# EAGLE design DigitalIO_3_3V_LevelShift (EAGLE 7.7.0)
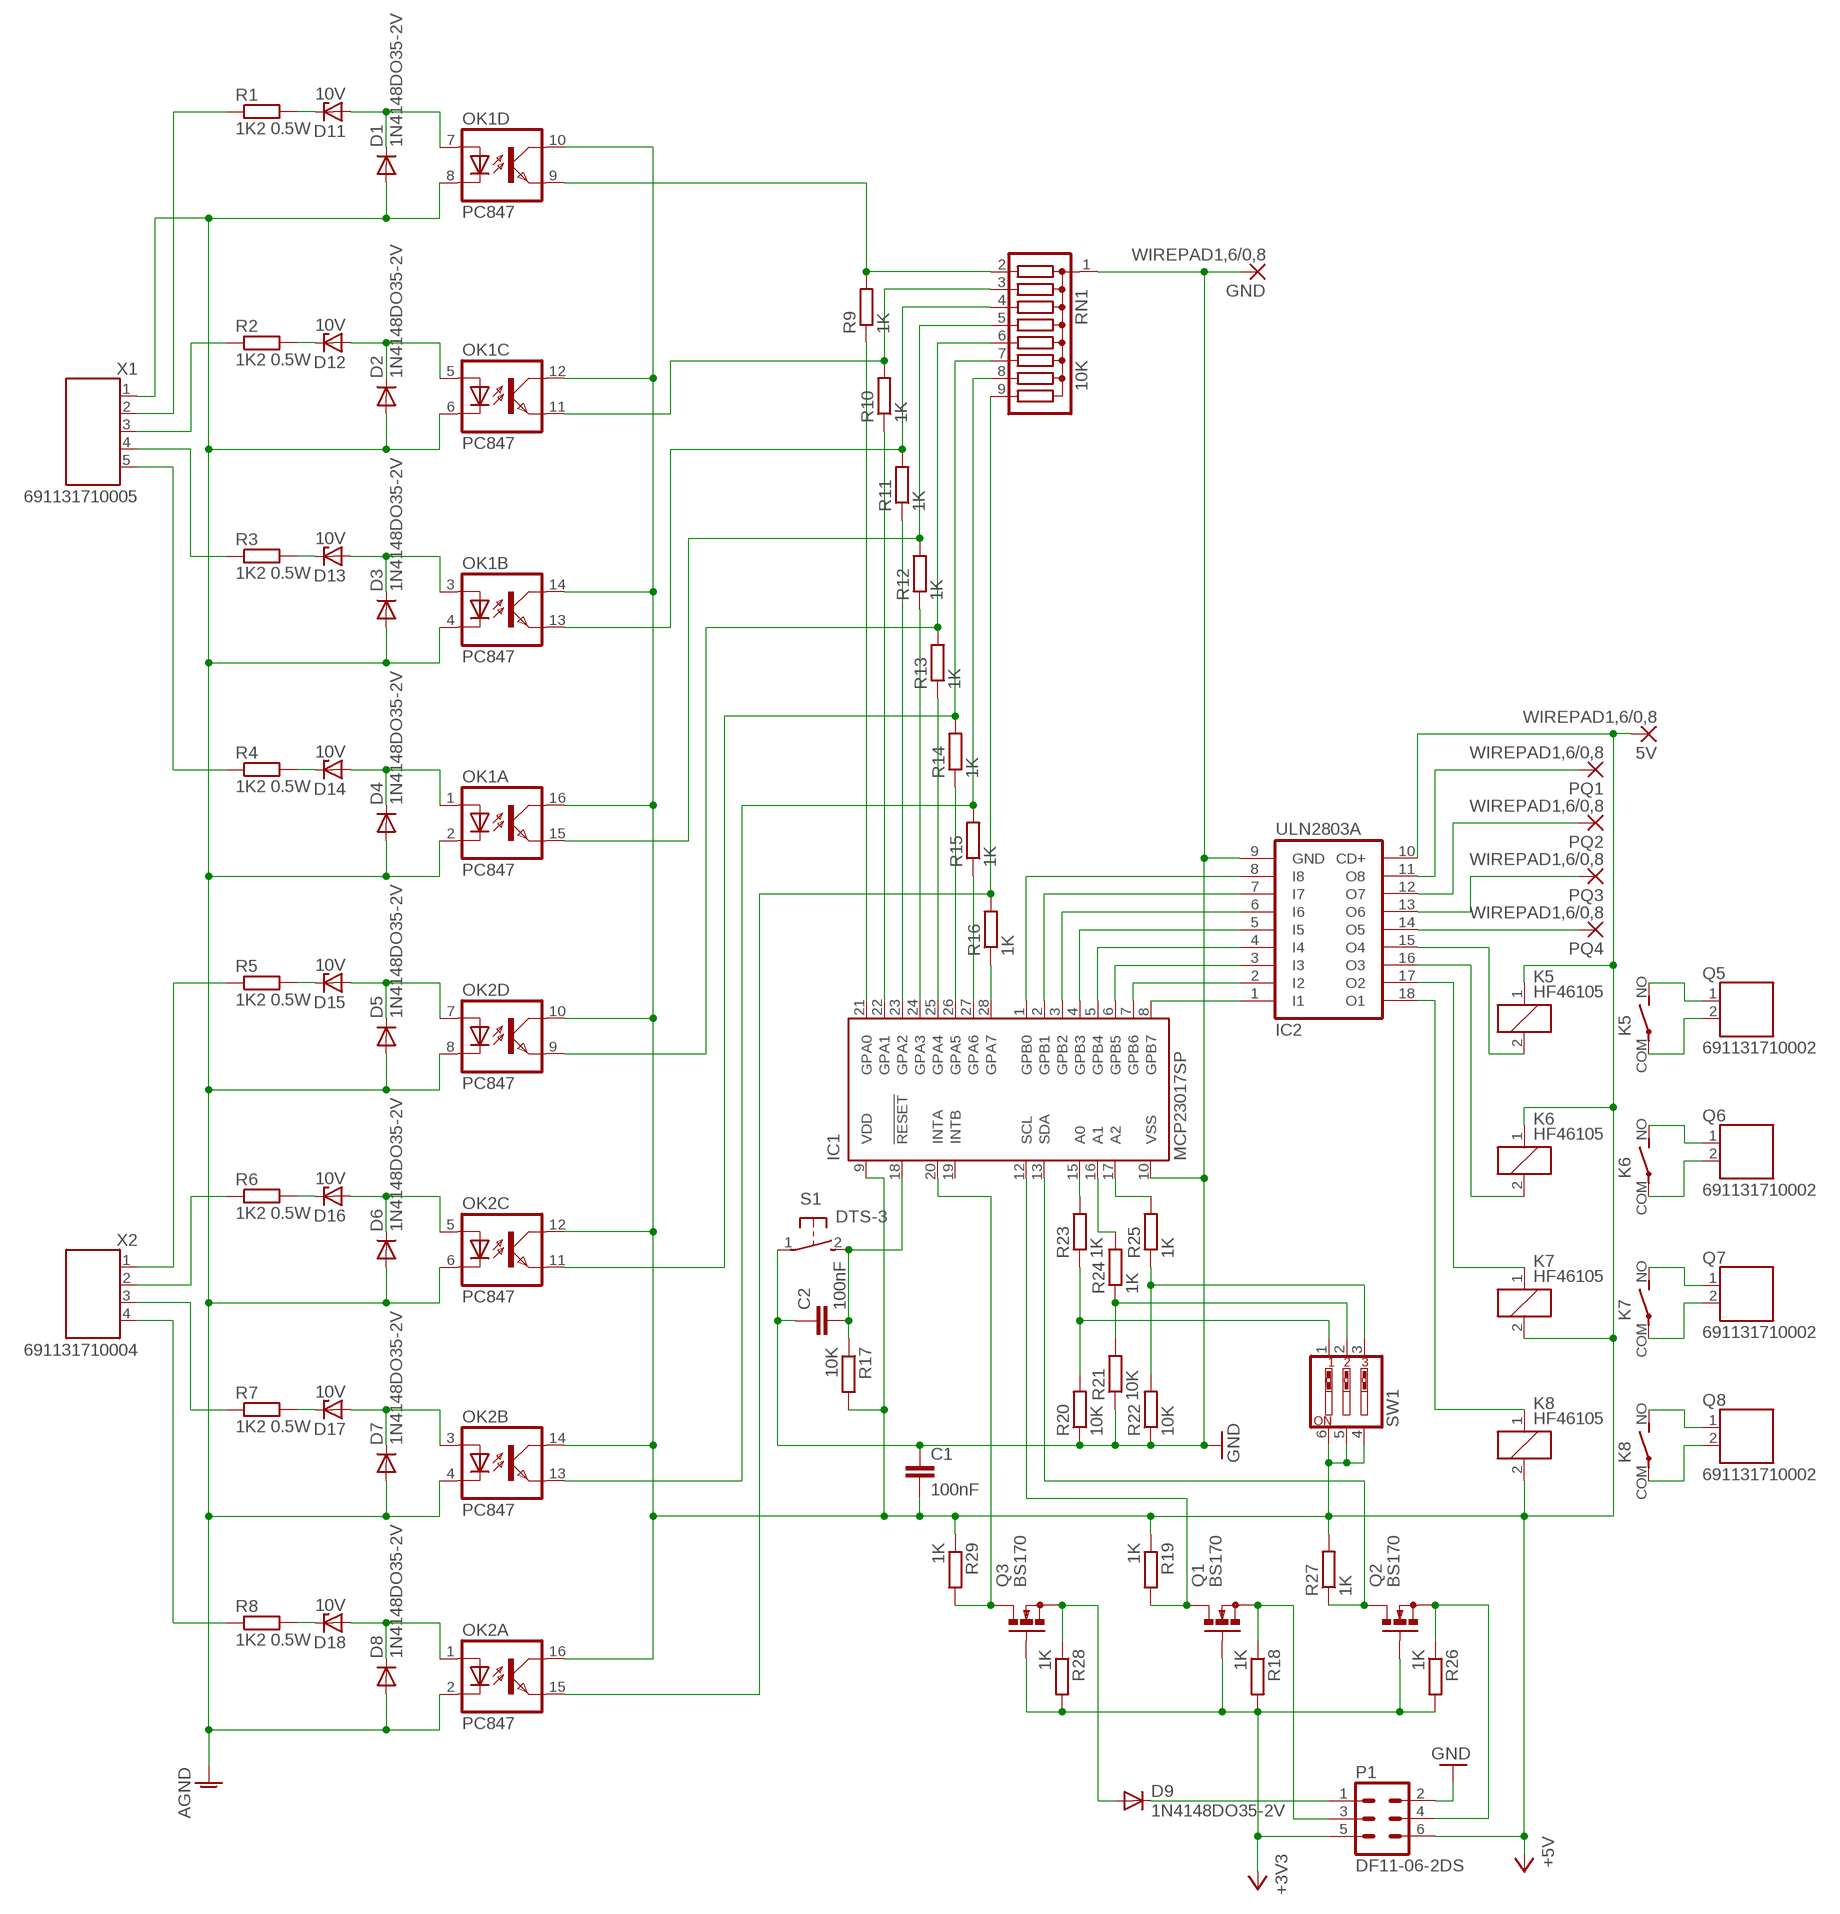
[diagram p0: schematic, sheet 1]

## Parts
5V  WIREPAD1,6/0,8  [1,6/0,8]
C1  100nF  C-EUC0805  [C0805]
C2  100nF  C-EUC0805  [C0805]
D1  1N4148DO35-2V  [DO35-2V]
D2  1N4148DO35-2V  [DO35-2V]
D3  1N4148DO35-2V  [DO35-2V]
D4  1N4148DO35-2V  [DO35-2V]
D5  1N4148DO35-2V  [DO35-2V]
D6  1N4148DO35-2V  [DO35-2V]
D7  1N4148DO35-2V  [DO35-2V]
D8  1N4148DO35-2V  [DO35-2V]
D9  1N4148DO35-2V  [DO35-2V]
D11  10V  ZENER-DIODEZD-2.5  [ZDIO-2.5]
D12  10V  ZENER-DIODEZD-2.5  [ZDIO-2.5]
D13  10V  ZENER-DIODEZD-2.5  [ZDIO-2.5]
D14  10V  ZENER-DIODEZD-2.5  [ZDIO-2.5]
D15  10V  ZENER-DIODEZD-2.5  [ZDIO-2.5]
D16  10V  ZENER-DIODEZD-2.5  [ZDIO-2.5]
D17  10V  ZENER-DIODEZD-2.5  [ZDIO-2.5]
D18  10V  ZENER-DIODEZD-2.5  [ZDIO-2.5]
GND  WIREPAD1,6/0,8  [1,6/0,8]
IC1  MCP23017SP  [DIL28-3]
IC2  ULN2803A  [DIL18]
K5  HF46105  [HF46]
K6  HF46105  [HF46]
K7  HF46105  [HF46]
K8  HF46105  [HF46]
OK1  PC847  [DIL16]
OK2  PC847  [DIL16]
P1  DF11-06-2DS  [DF11-06DP-2DS]
PQ1  WIREPAD1,6/0,8  [1,6/0,8]
PQ2  WIREPAD1,6/0,8  [1,6/0,8]
PQ3  WIREPAD1,6/0,8  [1,6/0,8]
PQ4  WIREPAD1,6/0,8  [1,6/0,8]
Q1  BS170  [SOT54E]
Q2  BS170  [SOT54E]
Q3  BS170  [SOT54E]
Q5  691131710002  [691131710002]
Q6  691131710002  [691131710002]
Q7  691131710002  [691131710002]
Q8  691131710002  [691131710002]
R1  1K2 0.5W  R-EU_0207/2V  [0207/2V]
R2  1K2 0.5W  R-EU_0207/2V  [0207/2V]
R3  1K2 0.5W  R-EU_0207/2V  [0207/2V]
R4  1K2 0.5W  R-EU_0207/2V  [0207/2V]
R5  1K2 0.5W  R-EU_0207/2V  [0207/2V]
R6  1K2 0.5W  R-EU_0207/2V  [0207/2V]
R7  1K2 0.5W  R-EU_0207/2V  [0207/2V]
R8  1K2 0.5W  R-EU_0207/2V  [0207/2V]
R9  1K  R-EU_0204/2V  [0204V]
R10  1K  R-EU_0204/2V  [0204V]
R11  1K  R-EU_0204/2V  [0204V]
R12  1K  R-EU_0204/2V  [0204V]
R13  1K  R-EU_0204/2V  [0204V]
R14  1K  R-EU_0204/2V  [0204V]
R15  1K  R-EU_0204/2V  [0204V]
R16  1K  R-EU_0204/2V  [0204V]
R17  10K  R-EU_0204/2V  [0204V]
R18  1K  R-EU_0204/2V  [0204V]
R19  1K  R-EU_0204/2V  [0204V]
R20  10K  R-EU_0204/2V  [0204V]
R21  10K  R-EU_0204/2V  [0204V]
R22  10K  R-EU_0204/2V  [0204V]
R23  1K  R-EU_0204/2V  [0204V]
R24  1K  R-EU_0204/2V  [0204V]
R25  1K  R-EU_0204/2V  [0204V]
R26  1K  R-EU_0204/2V  [0204V]
R27  1K  R-EU_0204/2V  [0204V]
R28  1K  R-EU_0204/2V  [0204V]
R29  1K  R-EU_0204/2V  [0204V]
RN1  10K  G08R  [SIL9]
S1  DTS-3  [DTS-3]
SW1  SW_DIP-3  [EDG-03]
X1  691131710005  [691131710005]
X2  691131710004  [691131710004]

## Nets
+3V3: P1.5 Q1.G Q2.G Q3.G R18.2 R26.2 R28.2
+5V: 5V.1(P) C1.2 IC1.9(VDD) IC2.10(CD+) K5.1 K6.1 K7.2 K8.2 OK1.10(D:COL) OK1.12(C:COL) OK1.14(B:COL) OK1.16(A:COL) OK2.10(D:COL) OK2.12(C:COL) OK2.14(B:COL) OK2.16(A:COL) P1.6 R17.2 R19.1 R27.2 R29.1 SW1.4 SW1.5 SW1.6
AGND: D1.A D2.A D3.A D4.A D5.A D6.A D7.A D8.A OK1.2(A:C) OK1.4(B:C) OK1.6(C:C) OK1.8(D:C) OK2.2(A:C) OK2.4(B:C) OK2.6(C:C) OK2.8(D:C) X1.1
GND: C1.1 C2.1 GND.1(P) IC1.10(VSS) IC2.9(GND) P1.2 R20.1 R21.1 R22.1 RN1.1 S1.1
N$1: IC1.8(GPB7) IC2.1(I1)
N$2: IC1.7(GPB6) IC2.2(I2)
N$3: IC1.6(GPB5) IC2.3(I3)
N$4: IC1.5(GPB4) IC2.4(I4)
N$5: IC1.4(GPB3) IC2.5(I5)
N$6: IC1.3(GPB2) IC2.6(I6)
N$7: IC1.2(GPB1) IC2.7(I7)
N$8: IC1.1(GPB0) IC2.8(I8)
N$9: D12.C R2.2
N$10: D11.C R1.2
N$11: R22.2 R25.1 SW1.3
N$12: D1.C D11.A OK1.7(D:A)
N$13: R6.1 X2.2
N$14: R2.1 X1.3
N$15: OK1.9(D:EMIT) R9.2 RN1.2
N$16: R3.1 X1.4
N$17: R7.1 X2.3
N$18: R1.1 X1.2
N$19: D2.C D12.A OK1.5(C:A)
N$20: OK1.11(C:EMIT) R10.2 RN1.3
N$21: D13.C R3.2
N$22: R4.1 X1.5
N$23: D3.C D13.A OK1.3(B:A)
N$24: R5.1 X2.1
N$25: OK1.13(B:EMIT) R11.2 RN1.4
N$26: R8.1 X2.4
N$27: D14.C R4.2
N$28: IC2.14(O5) PQ4.1(P)
N$29: D4.C D14.A OK1.1(A:A)
N$30: IC2.13(O6) PQ3.1(P)
N$31: OK1.15(A:EMIT) R12.2 RN1.5
N$32: IC2.12(O7) PQ2.1(P)
N$33: D15.C R5.2
N$34: IC2.11(O8) PQ1.1(P)
N$35: D5.C D15.A OK2.7(D:A)
N$36: D9.A Q3.S R28.1
N$37: OK2.9(D:EMIT) R13.2 RN1.6
N$38: K8.NO(2:S) Q8.1
N$39: D16.C R6.2
N$40: K8.COM(2:P) Q8.2
N$41: D6.C D16.A OK2.5(C:A)
N$42: IC2.15(O4) K5.2
N$43: OK2.11(C:EMIT) R14.2 RN1.7
N$44: K7.NO(2:S) Q7.1
N$45: D17.C R7.2
N$46: K7.COM(2:P) Q7.2
N$47: D7.C D17.A OK2.3(B:A)
N$48: IC2.16(O3) K6.2
N$49: OK2.13(B:EMIT) R15.2 RN1.8
N$50: IC1.15(A0) R23.2
N$51: D18.C R8.2
N$52: IC1.16(A1) R24.2
N$53: D8.C D18.A OK2.1(A:A)
N$54: IC2.17(O2) K7.1
N$55: OK2.15(A:EMIT) R16.2 RN1.9
N$56: IC2.18(O1) K8.1
N$57: C2.2 IC1.18(!RESET) R17.1 S1.2
N$58: IC1.12(SCL) Q1.D R19.2
N$59: IC1.21(GPA0) R9.1
N$60: IC1.22(GPA1) R10.1
N$61: IC1.13(SDA) Q2.D R27.1
N$62: IC1.23(GPA2) R11.1
N$63: IC1.28(GPA7) R16.1
N$64: IC1.27(GPA6) R15.1
N$65: IC1.26(GPA5) R14.1
N$66: K5.NO(2:S) Q5.1
N$67: IC1.25(GPA4) R13.1
N$68: IC1.24(GPA3) R12.1
N$69: P1.4 Q2.S R26.1
N$71: P1.3 Q1.S R18.1
N$75: K5.COM(2:P) Q5.2
N$77: R20.2 R23.1 SW1.1
N$78: R21.2 R24.1 SW1.2
N$79: IC1.17(A2) R25.2
N$80: D9.C P1.1
N$81: IC1.20(INTA) Q3.D R29.2
N$88: K6.NO(2:S) Q6.1
N$89: K6.COM(2:P) Q6.2
Unconnected: IC1.19(INTB)

## Library data of the parts
5V GND PQ1-PQ4 = wirepad:WIREPAD: Wire PAD connect wire on PCB
C1 C2 = rcl:C-EU: CAPACITOR, European symbol; MF: MULTICOMP; MPN: MCRR50104X7RK0050; OC_FARNELL: 1216440
D1-D9 = diode:1N4148: DIODE high speed (Philips); OC_FARNELL: unknown
D11-D18 = diode:ZENER-DIODE: Z-Diode; OC_FARNELL: unknown
IC1 = mcp:MCP23017: Input/Output Expander Source: https://www.microchip.com/en-us/product/MCP23017
IC2 = uln-udn:ULN2803A: DRIVER ARRAY; MF: STMICROELECTRONICS; MPN: ULN2803A; OC_FARNELL: 1094428
K5-K8 = hongfa:HF46?*: Slim Power Relay NAiS Source: http://www.hongfa.com/pro/pdf/HF46F_en.pdf; OC_FARNELL: unknown; OC_NEWARK: unknown
OK1 OK2 = optocoupler:PC847: SHARP OPTO COUPLER; OC_FARNELL: 9707735; OC_NEWARK: unknown
P1 = con-hirose-df11:DF11-06-2: HEADER; OC_FARNELL: unknown
Q1-Q3 = transistor-small-signal:BS170: N-CHANNEL MOS FET; MF: ON SEMICONDUCTOR; MPN: BS170G; OC_FARNELL: 9556192
Q5-Q8 = con-wuerth:691131710002: WR-TBL Terminal block - CUU5/2 CUU5/2GR - 2 Pins;=>Code : Con_TBL_Screw_PClamp_5.00_6911317100xx_691131710002 <http://katalog.we-online.de/media/images/eican/Con_TBL_Screw_PClamp_5.00_6911317100xx_pf2.jpg> Details see: http://katalog.we-online.de/em/datasheet/6911317100xx.pdf Created 11/23/2014, Karrer Zheng 2014 (C) Wurth Elektronik; OC_FARNELL: unknown
R1-R8 = resistor:R-EU_: RESISTOR, European symbol; MF: MULTICOMP; MPN: MCF 0.25W 1K2; OC_FARNELL: 9339124
R9-R17 R20-R25 = resistor:R-EU_: RESISTOR, European symbol; OC_FARNELL: unknown
R18 R19 R26-R29 = rcl:R-EU_: RESISTOR, European symbol; OC_FARNELL: unknown
RN1 = resistor-sil:G08R: SIL RESISTOR; OC_FARNELL: unknown; OC_NEWARK: unknown
S1 = switch-tact:DTS-3; OC_FARNELL: unknown
SW1 = special:SW_DIP-3: DIP SWITCH; OC_FARNELL: unknown
X1 = con-wuerth:691131710005: WR-TBL Terminal block - CUU5/5 - 5 Pins;=>Code : Con_TBL_Screw_PClamp_5.00_6911317100xx_691131710005 <http://katalog.we-online.de/media/images/eican/Con_TBL_Screw_PClamp_5.00_6911317100xx_pf2.jpg> Details see: http://katalog.we-online.de/em/datasheet/6911317100xx.pdf Created 11/3/2014, Karrer Zheng 2014 (C) Wurth Elektronik; OC_FARNELL: unknown
X2 = con-wuerth:691131710004: WR-TBL Terminal block - CUU5/4 - 4 Pins;=>Code : Con_TBL_Screw_PClamp_5.00_6911317100xx_691131710004 <http://katalog.we-online.de/media/images/eican/Con_TBL_Screw_PClamp_5.00_6911317100xx_pf2.jpg> Details see: http://katalog.we-online.de/em/datasheet/6911317100xx.pdf Created 11/3/2014, Karrer Zheng 2014 (C) Wurth Elektronik; OC_FARNELL: unknown

## Board
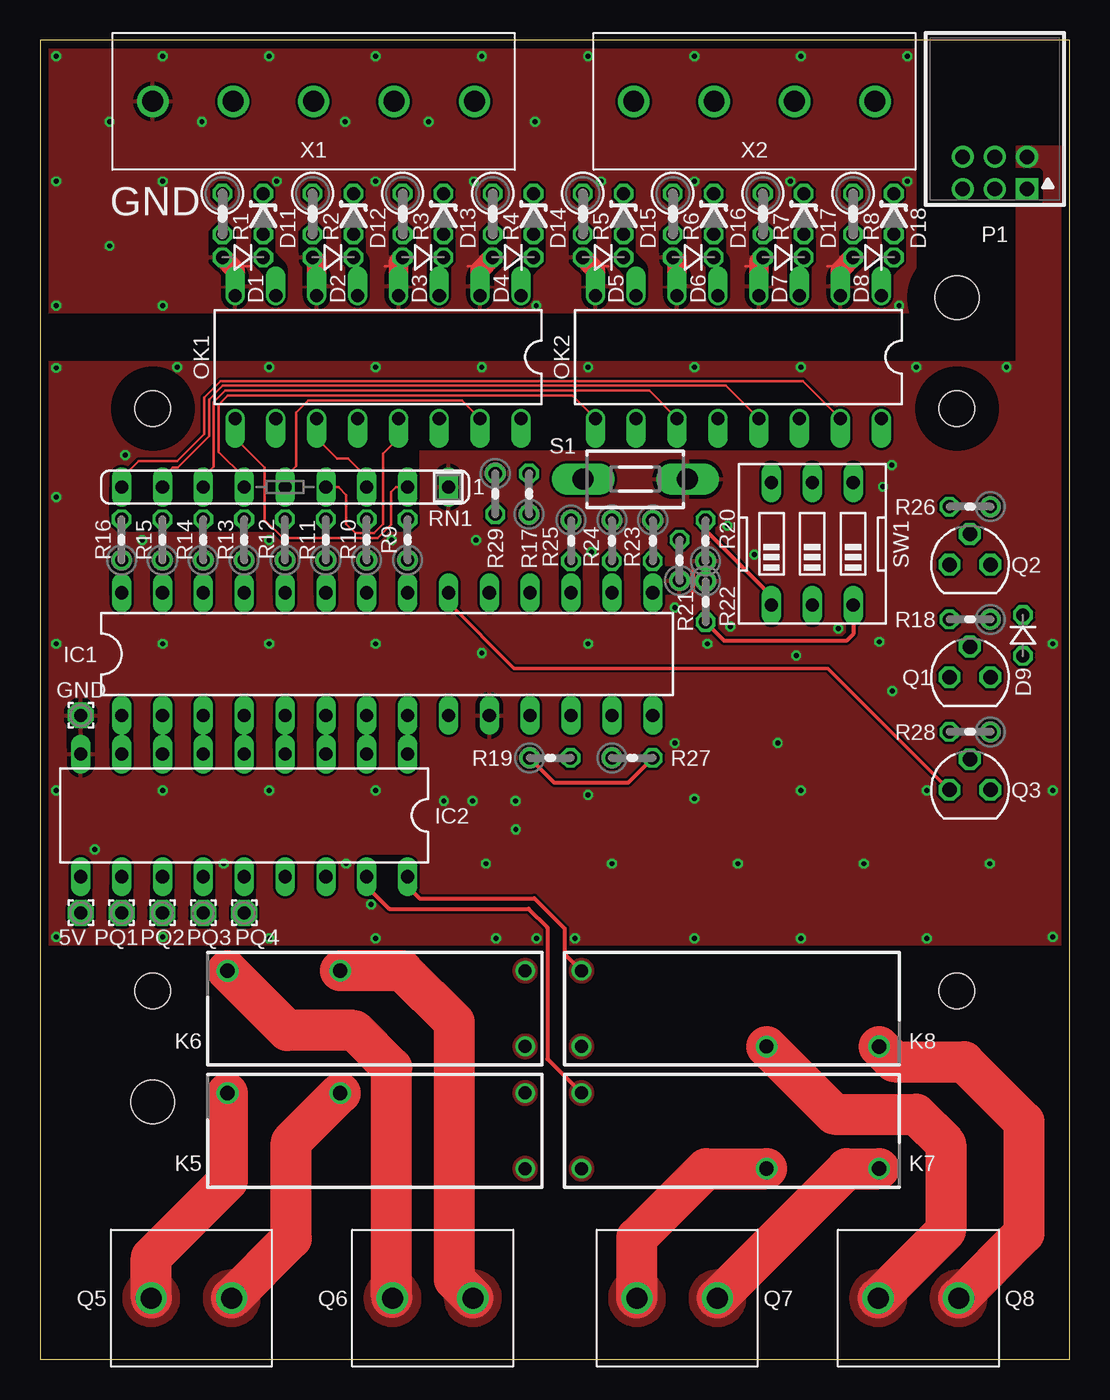
[diagram p1: board, top side]
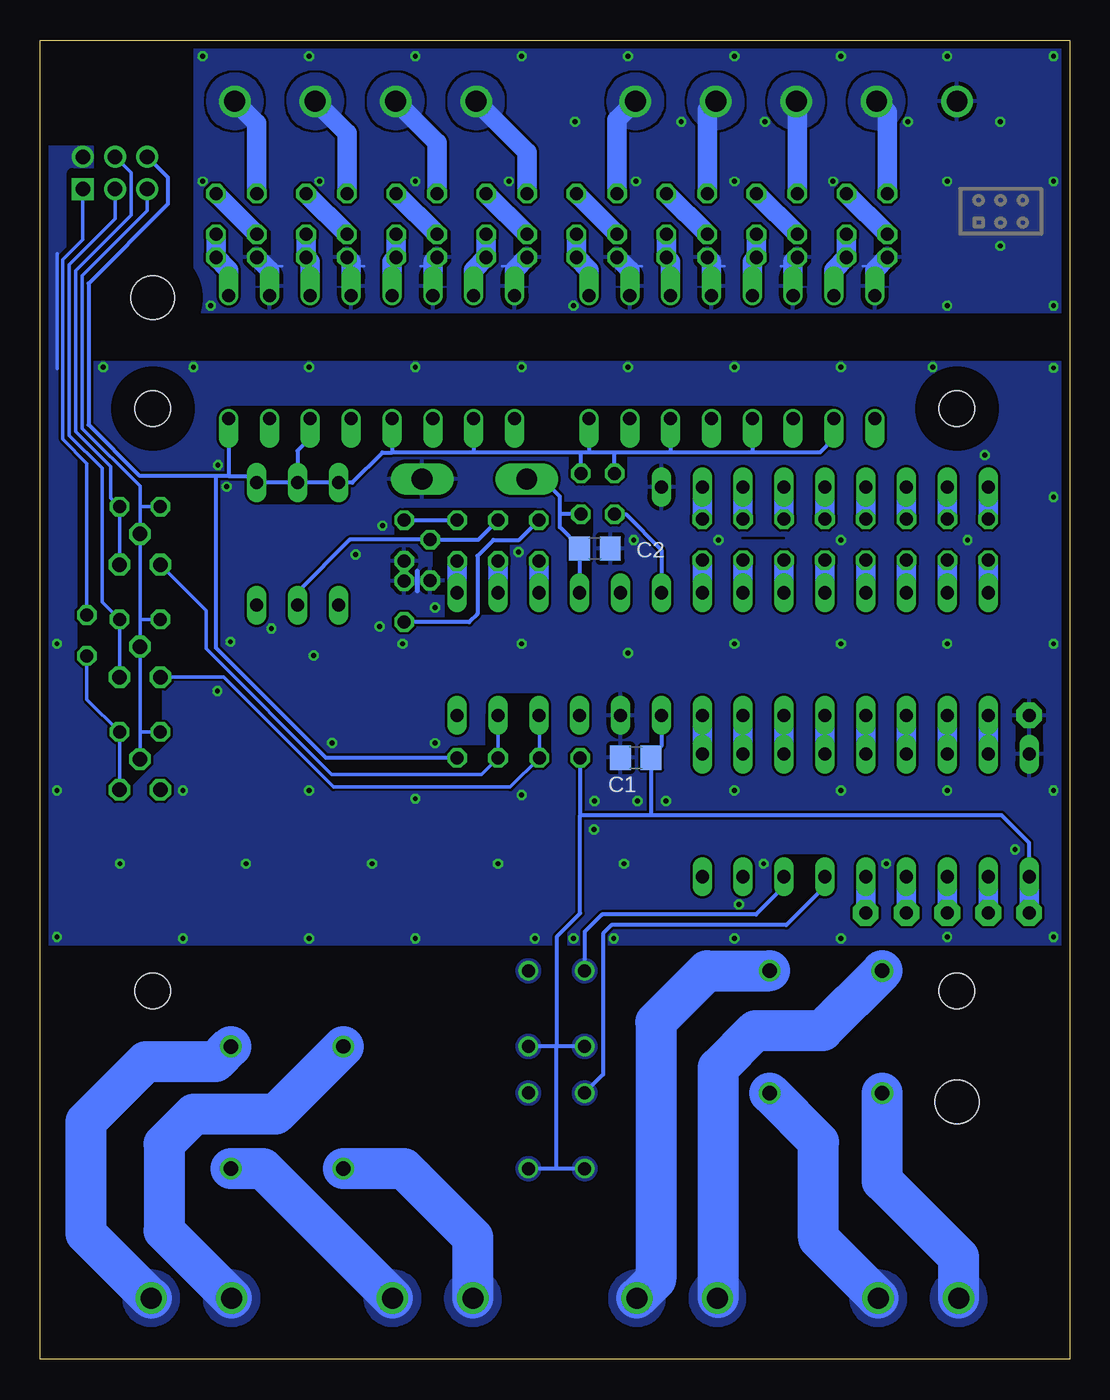
[diagram p2: board, bottom side, seen from below]

Size 64 x 82 mm. Coordinates in mm from the lower left corner, seen from the top.
Outline: 0,0 64,0 64,82 0,82 0,0
Copper layers (1*16): Top 0.035mm / dielectric 1.6mm / Bottom 0.035mm
Design rules "Elecrow *": minimum track width 6mil, minimum drill 12mil, track to track 6mil, track to pad 6mil, pad to pad 6mil, via to via 8mil, smd to smd 0mil, copper to edge 20mil, drill to drill 10mil, minimum pad ring 6mil, minimum via ring 6mil, stop-mask expansion 0mil, vias tented up to drill 100mil, thermal gap 10mil
Holes 2.7 mm at 57,66 7,16
Holes 2.2 mm at 57,59.1 57,22.9 7,22.9 7,59.1
tRestrict: area 4.4,56.5 to 9.6,61.7; area 54.4,56.5 to 59.6,61.7; area 54.4,20.3 to 59.6,25.5; area 4.4,20.3 to 9.6,25.5; area 53.9,62.9 to 60.1,69.1; area 3.9,12.9 to 10.1,19.1; area 16.3,66.8 to 17.1,68; area 27.5,66.8 to 28.2,68; area 38.7,66.8 to 39.5,68; area 44.8,66.8 to 45.5,68; area 49.9,66.8 to 50.6,68; area 59,72.1 to 62,73.7; 3 more areas; 125 lines
bRestrict: area 4.4,56.5 to 9.6,61.7; area 54.4,56.5 to 59.6,61.7; area 54.4,20.3 to 59.6,25.5; area 4.4,20.3 to 9.6,25.5; area 3.9,12.9 to 10.1,19.1; area 53.9,62.9 to 60.1,69.1; area 59,68 to 62,73.7; area 16.3,66.8 to 17.1,68; area 22.4,66.8 to 23.1,68; area 27.5,66.8 to 28.2,68; area 38.7,66.8 to 39.5,68; area 49.9,66.8 to 50.6,68; 4 more areas; 70 lines

### Footprints (pad centres in the part's own frame; a part is rotated, then mirrored left to right if it is on the bottom)
1,6/0,8 = drill 0.813 pad 1.6 octagon: 1 0,0
C0805 = smd 1.3 x 1.5: 1 -0.95,0; 2 0.95,0
DO35-2V = drill 0.813 octagon: A 1.27,0; C -1.27,0
ZDIO-2.5 = drill 0.813 octagon: A 1.27,0; C -1.27,0
DIL28-3 = drill 0.813 long: 1 -16.51,-3.81; 2 -13.97,-3.81; 3 -11.43,-3.81; 4 -8.89,-3.81; 5 -6.35,-3.81; 6 -3.81,-3.81; 7 -1.27,-3.81; 8 1.27,-3.81; 9 3.81,-3.81; 10 6.35,-3.81; 11 8.89,-3.81; 12 11.43,-3.81; 13 13.97,-3.81; 14 16.51,-3.81; 15 16.51,3.81; 16 13.97,3.81; 17 11.43,3.81; 18 8.89,3.81; 19 6.35,3.81; 20 3.81,3.81; 21 1.27,3.81; 22 -1.27,3.81; 23 -3.81,3.81; 24 -6.35,3.81; 25 -8.89,3.81; 26 -11.43,3.81; 27 -13.97,3.81; 28 -16.51,3.81
DIL18 = drill 0.813 long: 1 -10.16,-3.81; 2 -7.62,-3.81; 3 -5.08,-3.81; 4 -2.54,-3.81; 5 0,-3.81; 6 2.54,-3.81; 7 5.08,-3.81; 8 7.62,-3.81; 9 10.16,-3.81; 10 10.16,3.81; 11 7.62,3.81; 12 5.08,3.81; 13 2.54,3.81; 14 0,3.81; 15 -2.54,3.81; 16 -5.08,3.81; 17 -7.62,3.81; 18 -10.16,3.81
HF46 = drill 0.813: 1 -9.35,2.35; 2 -9.35,-2.35 | drill 0.889: COM 2.15,-2.35 | drill 0.9: NO 9.15,-2.35
DIL16 = drill 0.813 offset: 1 -8.89,-3.81; 2 -6.35,-3.81; 3 -3.81,-3.81; 4 -1.27,-3.81; 5 1.27,-3.81; 6 3.81,-3.81; 7 6.35,-3.81; 8 8.89,-3.81; 9 8.89,3.81; 10 6.35,3.81; 11 3.81,3.81; 12 1.27,3.81; 13 -1.27,3.81; 14 -3.81,3.81; 15 -6.35,3.81; 16 -8.89,3.81
DF11-06DP-2DS = drill 0.914 square: 1 2,-1 | drill 0.914: 2 2,1; 3 0,-1; 4 0,1; 5 -2,-1; 6 -2,1
SOT54E = drill 0.9 octagon: D -1.27,0; G 0,1.905; S 1.27,0
691131710002 = drill 1.3: 1 -2.5,0; 2 2.5,0
0207/2V = drill 0.813 octagon: 1 -1.27,0; 2 1.27,0
0204V = drill 0.813 octagon: 1 -1.27,0; 2 1.27,0
SIL9 = drill 0.813 long: 1 -10.16,0; 2 -7.62,0; 3 -5.08,0; 4 -2.54,0; 5 0,0; 6 2.54,0; 7 5.08,0; 8 7.62,0; 9 10.16,0
DTS-3 = drill 1.3 long: 1 -3.25,0; 2 3.25,0
EDG-03 = drill 0.813 long: 1 -2.54,-3.81; 2 0,-3.81; 3 2.54,-3.81; 4 2.54,3.81; 5 0,3.81; 6 -2.54,3.81
691131710005 = drill 1.3: 1 -10,0; 2 -5,0; 3 0,0; 4 5,0; 5 10,0
691131710004 = drill 1.3: 1 -7.5,0; 2 -2.5,0; 3 2.5,0; 4 7.5,0

### Placement (x,y rotation side)
5V  2.52,27.75 0 top
C1  26.97,37.4 0 bottom
C2  29.51,50.4 180 bottom
D1  12.6,68.5 180 top
D2  18.2,68.5 180 top
D3  23.8,68.5 180 top
D4  29.4,68.5 180 top
D5  35,68.5 180 top
D6  40.6,68.5 180 top
D7  46.2,68.5 180 top
D8  51.8,68.5 180 top
D9  61.1,45 270 top
D11  13.87,71.2 270 top
D12  19.47,71.2 270 top
D13  25.07,71.2 270 top
D14  30.67,71.2 270 top
D15  36.27,71.2 270 top
D16  41.87,71.2 270 top
D17  47.47,71.2 270 top
D18  53.07,71.2 270 top
GND  2.52,40.03 0 top
IC1  21.57,43.84 0 top
IC2  12.68,33.81 180 top
K5  20.8,14.2 180 top
K6  20.8,21.8 180 top
K7  43,14.2 0 top
K8  43,21.8 0 top
OK1  21,62.3 180 top
OK2  43.4,62.3 180 top
P1  59.35,73.75 0 top
PQ1  5.06,27.75 0 top
PQ2  7.6,27.75 0 top
PQ3  10.14,27.75 0 top
PQ4  12.68,27.75 0 top
Q1  57.8,42.4 0 top
Q2  57.8,49.4 0 top
Q3  57.8,35.4 0 top
Q5  9.4,3.8 0 top
Q6  24.4,3.8 0 top
Q7  39.6,3.8 180 top
Q8  54.6,3.8 180 top
R1  11.33,71.2 270 top
R2  16.93,71.2 270 top
R3  22.53,71.2 270 top
R4  28.13,71.2 270 top
R5  33.73,71.2 270 top
R6  39.33,71.2 270 top
R7  44.93,71.2 270 top
R8  50.53,71.2 270 top
R9  22.84,50.95 90 top
R10  20.3,50.95 90 top
R11  17.76,50.95 90 top
R12  15.22,50.95 90 top
R13  12.68,50.95 90 top
R14  10.14,50.95 90 top
R15  7.6,50.95 90 top
R16  5.06,50.95 90 top
R17  30.39,53.8 90 top
R18  57.8,46 180 top
R19  31.7,37.39 0 top
R20  41.37,50.89 90 top
R21  39.75,49.68 90 top
R22  41.37,47.1 270 top
R23  38.08,50.89 270 top
R24  35.54,50.89 270 top
R25  33,50.89 270 top
R26  57.8,53 180 top
R27  36.81,37.39 0 top
R28  57.8,39 180 top
R29  28.29,53.8 270 top
RN1  15.22,54.22 180 top
S1  37,54.71 180 top
SW1  48,50.69 0 top
X1  17,78.2 0 top
X2  44.4,78.2 0 top

### Tracks (layer width: path | path; a pad name or v marks a point on that pad's centre or on a via)
+3V3
  Bottom 0.203: P1.5 57.35,71.4 61.4,67.35 61.4,57.87 57.8,54.27 57.8,53 | 57.8,53 Q2.G 57.8,46 | 57.8,46 Q1.G 57.8,39 | R26.2 57.8,53 | R18.2 57.8,46 | 57.8,39 Q3.G | R28.2 57.8,39
+5V
  Top 0.254: R27.2 36.53,35.84 31.98,35.84 R19.1
  Bottom 0.254: 30.43,33.81 30.43,27.72 31.9,26.25 31.9,19.45 | 26.02,33.81 4.23,33.81 2.52,32.1 IC2.10 | 26.02,33.81 30.43,33.81 | 52.29,54.91 50.54,54.91 SW1.4 SW1.5 | 30.39,56.38 37.05,56.38 | P1.6 56.05,73.45 56.05,71.83 61,66.88 61,58.1 57.81,54.91 53.07,54.91 | 19.73,56.38 24.81,56.38 | 24.81,56.38 28.29,56.38 | 28.29,56.38 29.89,56.38 | 29.89,56.38 30.39,56.38 | R19.1 30.43,33.81 | 26.02,33.81 C1.2 26.02,37.48 25.38,38.12 IC1.9 | 53.07,54.91 53.07,44.23 46.23,37.39 R27.2 | OK2.16 52.29,54.91 | 52.29,54.91 53.07,54.91 | OK2.12 42.13,56.38 | OK2.10 37.05,56.38 | OK1.14 24.81,56.38 | OK1.12 19.73,56.38 | R17.2 30.39,56.38 | R29.1 28.29,56.38 | 42.13,56.38 42.73,56.38 44.61,54.5 SW1.6 SW1.5 | 37.05,56.38 42.13,56.38 | 19.73,56.38 15.54,56.38 14.65,57.27 OK1.10 | OK1.16 29.89,56.38 | OK2.14 47.21,57.27 48,56.48 SW1.5 | K6.1 31.9,19.45 | K7.2 K5.1 31.9,11.85 31.9,19.45 | 31.9,19.45 K8.2
  Bottom 1.215: 5V.1 IC2.10
  pour Bottom (no thermals): 29.67,11.38 arc180 30.63,12.32 arc180
  pour Top (no thermals): 29.67,11.38 arc180 30.63,12.32 arc180
  pour Bottom (no thermals): 33.17,11.38 arc180 34.13,12.32 arc180
  pour Top (no thermals): 33.17,11.38 arc180 34.13,12.32 arc180
  pour Bottom (no thermals): 33.17,18.98 arc180 34.13,19.92 arc180
  pour Top (no thermals): 33.17,18.98 arc180 34.13,19.92 arc180
  pour Bottom (no thermals): 29.67,18.98 arc180 30.63,19.92 arc180
  pour Top (no thermals): 29.67,18.98 arc180 30.63,19.92 arc180
AGND  (via drill 0.3)
  Top 0.152: 48.95,67.94 49.25,67.94 | 43.85,67.94 44.15,67.94 | 40.05,67.94 40.35,67.94 | 35,67.94 35.3,67.94 | 26.6,67.94 26.9,67.94 | 21.45,67.94 21.75,67.94 | 17.65,67.94 17.95,67.94 | 12.65,67.94 12.95,67.94
  Top 1.219: D2.A 17.19,68.24 OK1.6 | D3.A 22.27,68.24 OK1.4 | OK1.2 27.35,67.72 D4.A | OK2.8 34.51,67.72 D5.A | D6.A 39.59,68.24 OK2.6 | D7.A 44.67,68.24 OK2.4 | D8.A 49.75,67.72 OK2.2 | OK1.8 12.11,67.72 D1.A
  Bottom 0.152: 43.85,67.94 44.15,67.94 | 40.05,67.94 40.35,67.94 | 35,67.94 35.3,67.94 | 26.6,67.94 26.9,67.94 | 21.45,67.94 21.75,67.94 | 17.65,67.94 17.95,67.94 | 12.55,67.94 12.85,67.94 | 48.95,67.94 49.25,67.94
  Bottom 1.219: OK1.8 12.11,67.72 D1.A | D2.A 17.19,68.24 OK1.6 | D3.A 22.27,68.24 OK1.4 | OK1.2 27.35,67.72 D4.A | OK2.8 34.51,67.72 D5.A | D6.A 39.59,68.24 OK2.6 | D7.A 44.67,68.24 OK2.4 | D8.A 49.75,67.72 OK2.2
  Bottom 1.27: X1.1
  other vias: 1,81 1,73.22 1,65.5 7.62,81 10.05,76.93 7.62,73.22 7.62,65.5 14.23,81 30.76,76.93 18.95,76.93 20.84,81 24.15,76.93 20.84,73.22 27.45,81 14.71,73.22 26.95,73.22 34.07,81 34.87,73.22 30.84,65.5 40.68,81 40.68,73.22 47.29,81 46.64,73.22 53.9,81 53.9,73.22 4.31,76.93 4.31,69.21 53.4,65.5
  pour Bottom (rank 2): 0,82 0,65.1 54.4,65.1 54.4,82
  pour Bottom (isolate 0.305): 5.9,77 arc180 8.1,79.4 arc180
  pour Top (rank 2): 0,82 0,65.1 54.4,65.1 54.4,82
GND  (via drill 0.3)
  Top 0.305: 40.56,48.97 40.56,47.76
  Bottom 0.203: 62.96,61.57 62.96,68.72
  Bottom 0.305: 40.56,48.97 40.56,47.76
  other vias: 1,61.63 60.08,61.67 1,26.25 42.73,51.82 21.84,50.92 52.4,54.24 52.95,55.58 14.23,50.92 6.34,50.92 44.39,50.03 42.91,45.55 39.45,46.73 20.84,26.16 28.34,26.16 62.96,26.25 5.28,56.2 14.23,61.67 20.84,61.67 27.45,61.67 34.07,61.67 40.68,61.67 47.29,61.67 8.52,61.67 54.47,61.67 30.85,26.16 33.25,26.16 7.62,26.25 14.23,26.16 40.68,26.16 47.29,26.16 55.13,26.16 1,35.37 7.62,35.37 14.23,35.37 20.84,35.37 29.54,34.7 34.07,35.09 40.68,34.85 47.29,35.37 62.96,35.37 1,44.48 7.62,44.48 14.23,44.48 20.84,44.48 27.45,43.9 34.07,44.48 41.48,44.48 47,43.75 62.96,44.48 1,53.59 55.13,35.37 39.45,38.3 45.85,38.32 52.17,44.6 52.98,41.55 25.09,34.7 29.56,32.94 3.4,31.7 59.04,30.81 51.21,30.81 43.37,30.81 35.54,30.81 11.41,30.81 19.02,30.81 27.71,30.81 26.87,34.7 49.63,45.43 27.1,50.92 34.27,50.18 20.57,28.27
  pour Bottom: 0,62 64,62 64,25.8 0,25.8
  pour Bottom (isolate 0.305, no thermals): 60.73,75.38 64,75.38 64,62 60.73,62
  pour Top: 0,62 64,62 64,25.8 0,25.8
  pour Top (isolate 0.305, no thermals): 60.73,75.38 64,75.38 64,62 60.73,62
N$1
  Bottom 1.22: IC1.8 IC2.1
N$2
  Bottom 1.22: IC1.7 IC2.2
N$3
  Bottom 1.22: IC1.6 IC2.3
N$4
  Bottom 1.22: IC1.5 IC2.4
N$5
  Bottom 1.22: IC1.4 IC2.5
N$6
  Bottom 1.22: IC1.3 IC2.6
N$7
  Bottom 1.22: IC1.2 IC2.7
N$8
  Bottom 1.22: IC1.1 IC2.8
N$9
  Bottom 1.219: R2.2 D12.C
N$10
  Bottom 1.219: R1.2 D11.C
N$11
  Top 0.254: R22.2 42.54,44.66 50.11,44.66 50.54,45.08 SW1.3
  Bottom 0.254: R22.2 37.34,45.83 36.83,46.34 36.83,49.94 35.83,50.94 34.22,50.94 R25.1
N$12
  Bottom 1.219: D11.A D1.C 14.65,67.72 OK1.7
N$13
  Bottom 1.219: R6.1 39.33,75.63 X2.2
  pour Bottom (no thermals): 40.8,77 arc180 43,79.4 arc180
N$14
  Bottom 1.219: R2.1 16.93,78.13 X1.3
  pour Bottom (no thermals): 15.9,77 arc180 18.1,79.4 arc180
N$15
  Top 0.152: RN1.2 22.11,54.22 21.8,53.91 21.8,51.88 20.97,51.05 15.09,51.05 13.96,52.18 13.96,55.42 12.11,57.27 OK1.9
  Bottom 1.22: RN1.2 R9.2
N$16
  Bottom 1.219: R3.1 22.53,77.67 X1.4
  pour Bottom (no thermals): 20.9,77 arc180 23.1,79.4 arc180
N$17
  Bottom 1.219: R7.1 44.93,76.23 X2.3
  pour Bottom (no thermals): 45.8,77 arc180 48,79.4 arc180
N$18
  Bottom 1.219: R1.1 11.33,77.53 X1.2
  pour Bottom (no thermals): 10.9,77 arc180 13.1,79.4 arc180
N$19
  Bottom 1.219: D12.A D2.C 19.73,68.24 OK1.5
N$20
  Top 0.152: RN1.3 20.3,54.83 19.13,56 18.46,56 17.19,57.27 OK1.11
  Bottom 0.254: R10.2
  Bottom 1.22: RN1.3 R10.2
N$21
  Bottom 1.219: R3.2 D13.C
N$22
  Bottom 1.219: R4.1 28.13,77.07 X1.5
  pour Bottom (no thermals): 25.9,77 arc180 28.1,79.4 arc180
N$23
  Bottom 1.219: D13.A D3.C 24.81,68.24 OK1.3
N$24
  Bottom 1.219: R5.1 33.73,75.03 X2.1
  pour Bottom (no thermals): 35.8,77 arc180 38,79.4 arc180
N$25
  Top 0.152: RN1.4 18.54,54.22 19.03,53.73 19.03,51.93 19.6,51.36 20.77,51.36 21.32,51.91 21.32,56.32 22.27,57.27 OK1.13
  Bottom 0.254: 17.76,52.25 R11.2
  Bottom 1.22: RN1.4 17.76,52.25
N$26
  Bottom 1.219: R8.1 50.53,76.83 X2.4
  pour Bottom (no thermals): 50.8,77 arc180 53,79.4 arc180
N$27
  Bottom 1.219: R4.2 D14.C
N$28
  Bottom 1.22: IC2.14 PQ4.1
N$29
  Bottom 1.219: D14.A D4.C 29.89,67.72 OK1.1
N$30
  Bottom 1.22: IC2.13 PQ3.1
N$31
  Top 0.152: RN1.5 15.22,54.83 15.92,55.52 15.92,58.86 16.66,59.6 26.24,59.6 OK1.15
  Bottom 0.152: R12.2 15.22,52.25
  Bottom 1.22: 15.22,52.25 RN1.5
N$32
  Bottom 1.22: IC2.12 PQ2.1
N$33
  Bottom 1.219: R5.2 D15.C
N$34
  Bottom 1.22: IC2.11 PQ1.1
N$35
  Bottom 1.219: D15.A D5.C 37.05,67.72 OK2.7
N$36
  Bottom 0.203: Q3.S R28.1 61.1,41.03 D9.A
N$37
  Top 0.152: RN1.6 12.68,54.83 11.1,56.41 11.1,59.34 11.66,59.91 33.09,59.91 OK2.9
  Bottom 0.152: 12.68,52.24 R13.2
  Bottom 1.22: RN1.6 12.68,52.24
N$38
  Top 2.54: Q8.1 57.13,3.8 61.16,7.83 61.16,14.77 57.43,18.5 53.1,18.5 K8.NO
  Bottom 2.54: Q8.1 57.13,3.8 61.16,7.83 61.16,14.77 57.43,18.5 53.1,18.5 K8.NO
  pour Bottom (no thermals): 56,2.6 arc180 58.2,5 arc180
  pour Top (no thermals): 56,2.6 arc180 58.2,5 arc180
N$39
  Bottom 1.219: R6.2 D16.C
N$40
  Top 2.54: Q8.2 56.3,8 56.3,13.38 54.45,15.23 49.37,15.23 K8.COM
  Bottom 2.54: Q8.2 56.3,8 56.3,13.38 54.45,15.23 49.37,15.23 K8.COM
  pour Bottom (no thermals): 51,2.6 arc180 53.2,5 arc180
  pour Top (no thermals): 51,2.6 arc180 53.2,5 arc180
N$41
  Bottom 1.219: D16.A D6.C 42.13,68.24 OK2.5
N$42
  Bottom 0.254: IC2.15 15.22,29.39 17.61,27 28.47,27 29,26.47 29,17.7 K5.2
  pour Bottom (no thermals): 29.67,16.08 arc180 30.63,17.02 arc180
  pour Top (no thermals): 29.67,16.08 arc180 30.63,17.02 arc180
N$43
  Top 0.152: RN1.7 10.14,54.83 10.79,55.48 10.79,59.49 11.51,60.21 37.87,60.21 OK2.11
  Bottom 1.22: RN1.7 R14.2
N$44
  Top 2.54: Q7.1 50.15,11.85 K7.NO
  Bottom 2.54: Q7.1 50.15,11.85 K7.NO
  pour Bottom (no thermals): 41,2.6 arc180 43.2,5 arc180
  pour Top (no thermals): 41,2.6 arc180 43.2,5 arc180
N$45
  Bottom 1.219: R7.2 D17.C
N$46
  Top 2.54: Q7.2 37.1,7.56 41.39,11.85 K7.COM
  Bottom 2.54: Q7.2 37.1,7.56 41.39,11.85 K7.COM
  pour Bottom (no thermals): 36,2.6 arc180 38.2,5 arc180
  pour Top (no thermals): 36,2.6 arc180 38.2,5 arc180
N$47
  Bottom 1.219: D17.A D7.C 47.21,68.24 OK2.3
N$48
  Bottom 0.254: IC2.16 17.76,29.39 19.5,27.65 29.07,27.65 30.15,26.57 K6.2
  pour Bottom (no thermals): 29.67,23.68 arc180 30.63,24.62 arc180
  pour Top (no thermals): 29.67,23.68 arc180 30.63,24.62 arc180
N$49
  Top 0.152: RN1.8 7.6,54.82 8.23,55.45 8.56,55.45 10.49,57.38 10.49,59.65 11.36,60.52 42.65,60.52 OK2.13
  Bottom 0.254: R15.2 7.6,52.26
  Bottom 1.22: 7.6,52.26 RN1.8
N$50
  Bottom 1.22: R23.2 IC1.15
N$51
  Bottom 1.219: R8.2 D18.C
N$52
  Bottom 1.22: R24.2 IC1.16
N$53
  Bottom 1.219: D18.A D8.C 52.29,67.72 OK2.1
N$54
  Top 0.254: IC2.17 20.3,29.4 21.7,28 30.37,28 31.53,26.84 31.53,18.67 K7.1
  pour Bottom (no thermals): 33.17,16.08 arc180 34.13,17.02 arc180
  pour Top (no thermals): 33.17,16.08 arc180 34.13,17.02 arc180
N$55
  Top 0.152: RN1.9 5.06,54.79 6.12,55.85 8.51,55.85 10.19,57.53 10.19,59.79 11.21,60.82 47.42,60.82 OK2.15
  Bottom 1.22: R16.2 RN1.9
N$56
  Top 0.254: IC2.18 22.84,29.38 23.57,28.65 30.73,28.65 32.6,26.78 32.6,25.2 K8.1
  pour Bottom (no thermals): 33.17,23.68 arc180 34.13,24.62 arc180
  pour Top (no thermals): 33.17,23.68 arc180 34.13,24.62 arc180
N$57
  Bottom 0.254: IC1.18 C2.2 30.46,50.49 31.69,51.72 31.69,52.53 | R17.1 31.69,52.53 | 31.69,52.53 31.69,53.64 32.76,54.71 S1.2
N$58
  Bottom 0.203: 32.97,40.03 R19.2 34.79,35.57 45.77,35.57 52.6,42.4 Q1.D
  Bottom 0.254: IC1.12 32.97,40.03
N$59
  Bottom 1.22: R9.1 IC1.21
N$60
  Bottom 1.22: R10.1 IC1.22
N$61
  Bottom 0.203: IC1.13 R27.1 36.56,36.37 45.87,36.37 53.68,44.18 53.68,46.55 Q2.D
N$62
  Bottom 0.254: R11.1 17.76,49.65
  Bottom 1.22: 17.76,49.65 IC1.23
N$63
  Bottom 0.254: R16.1
  Bottom 1.22: R16.1 IC1.28
N$64
  Bottom 0.254: R15.1 7.6,49.64
  Bottom 1.22: 7.6,49.64 IC1.27
N$65
  Bottom 1.22: R14.1 IC1.26
N$66
  Top 2.54: Q5.1 6.9,6.34 11.65,11.09 K5.NO
  Bottom 2.54: Q5.1 6.9,6.34 11.65,11.09 K5.NO
  pour Bottom (no thermals): 5.8,2.6 arc180 8,5 arc180
  pour Top (no thermals): 5.8,2.6 arc180 8,5 arc180
N$67
  Bottom 0.254: R13.1 12.68,49.66
  Bottom 1.22: 12.68,49.66 IC1.25
N$68
  Bottom 0.254: R12.1 15.22,49.65
  Bottom 1.22: 15.22,49.65 IC1.24
N$69
  Bottom 0.203: P1.4 58.35,73.75 58.35,71.13 61.8,67.68 61.8,57.66 59.62,55.48 59.62,53.55 R26.1 Q2.S
N$71
  Bottom 0.203: P1.3 59.35,70.91 62.2,68.06 62.2,57.43 60.16,55.39 60.16,47.09 R18.1 Q1.S
N$75
  Top 2.54: Q5.2 15.61,7.51 15.61,13.51 K5.COM
  Bottom 2.54: Q5.2 15.61,7.51 15.61,13.51 K5.COM
  pour Bottom (no thermals): 10.8,2.6 arc180 13,5 arc180
  pour Top (no thermals): 10.8,2.6 arc180 13,5 arc180
N$77
  Top 0.254: R20.2 41.37,51.54 45.46,47.45 SW1.1
  Bottom 0.254: R20.2 R23.1
N$78
  Bottom 0.254: R24.1 36.75,50.95 R21.2 44.76,50.95 48,47.71 SW1.2
N$79
  Bottom 1.22: IC1.17 R25.2
N$80
  Bottom 0.203: P1.1 61.35,69.6 62.6,68.35 62.6,57.19 61.1,55.69 D9.C
N$81
  Top 0.203: Q3.D 48.98,42.95 29.47,42.95 25.38,47.04 IC1.20
  Bottom 0.254: R29.2 27.59,52.53 25.38,50.32 IC1.20
N$88
  Top 2.54: K6.NO 15.36,20.44 19.53,20.44 21.85,18.12 21.85,3.85
  Bottom 2.54: K6.NO 15.36,20.44 19.53,20.44 21.85,18.12 21.85,3.85
  pour Bottom (no thermals): 20.8,2.6 arc180 23,5 arc180
  pour Top (no thermals): 20.8,2.6 arc180 23,5 arc180
N$89
  Top 2.54: Q6.2 25.73,4.97 25.73,20.96 22.54,24.15 K6.COM
  Bottom 2.54: Q6.2 25.73,4.97 25.73,20.96 22.54,24.15 K6.COM
  pour Bottom (no thermals): 25.8,2.6 arc180 28,5 arc180
  pour Top (no thermals): 25.8,2.6 arc180 28,5 arc180

### Text on the board
tNames: GND
tDocu: INT-Settings: / 1. Mirror / 2. Open drain
bDocu: 5.0V | SDA | GND | 3.3V | SCL | INT/NC | 8DI/8DO